# EAGLE design Trig to Gate Converter main V1 (EAGLE 7.7.0)
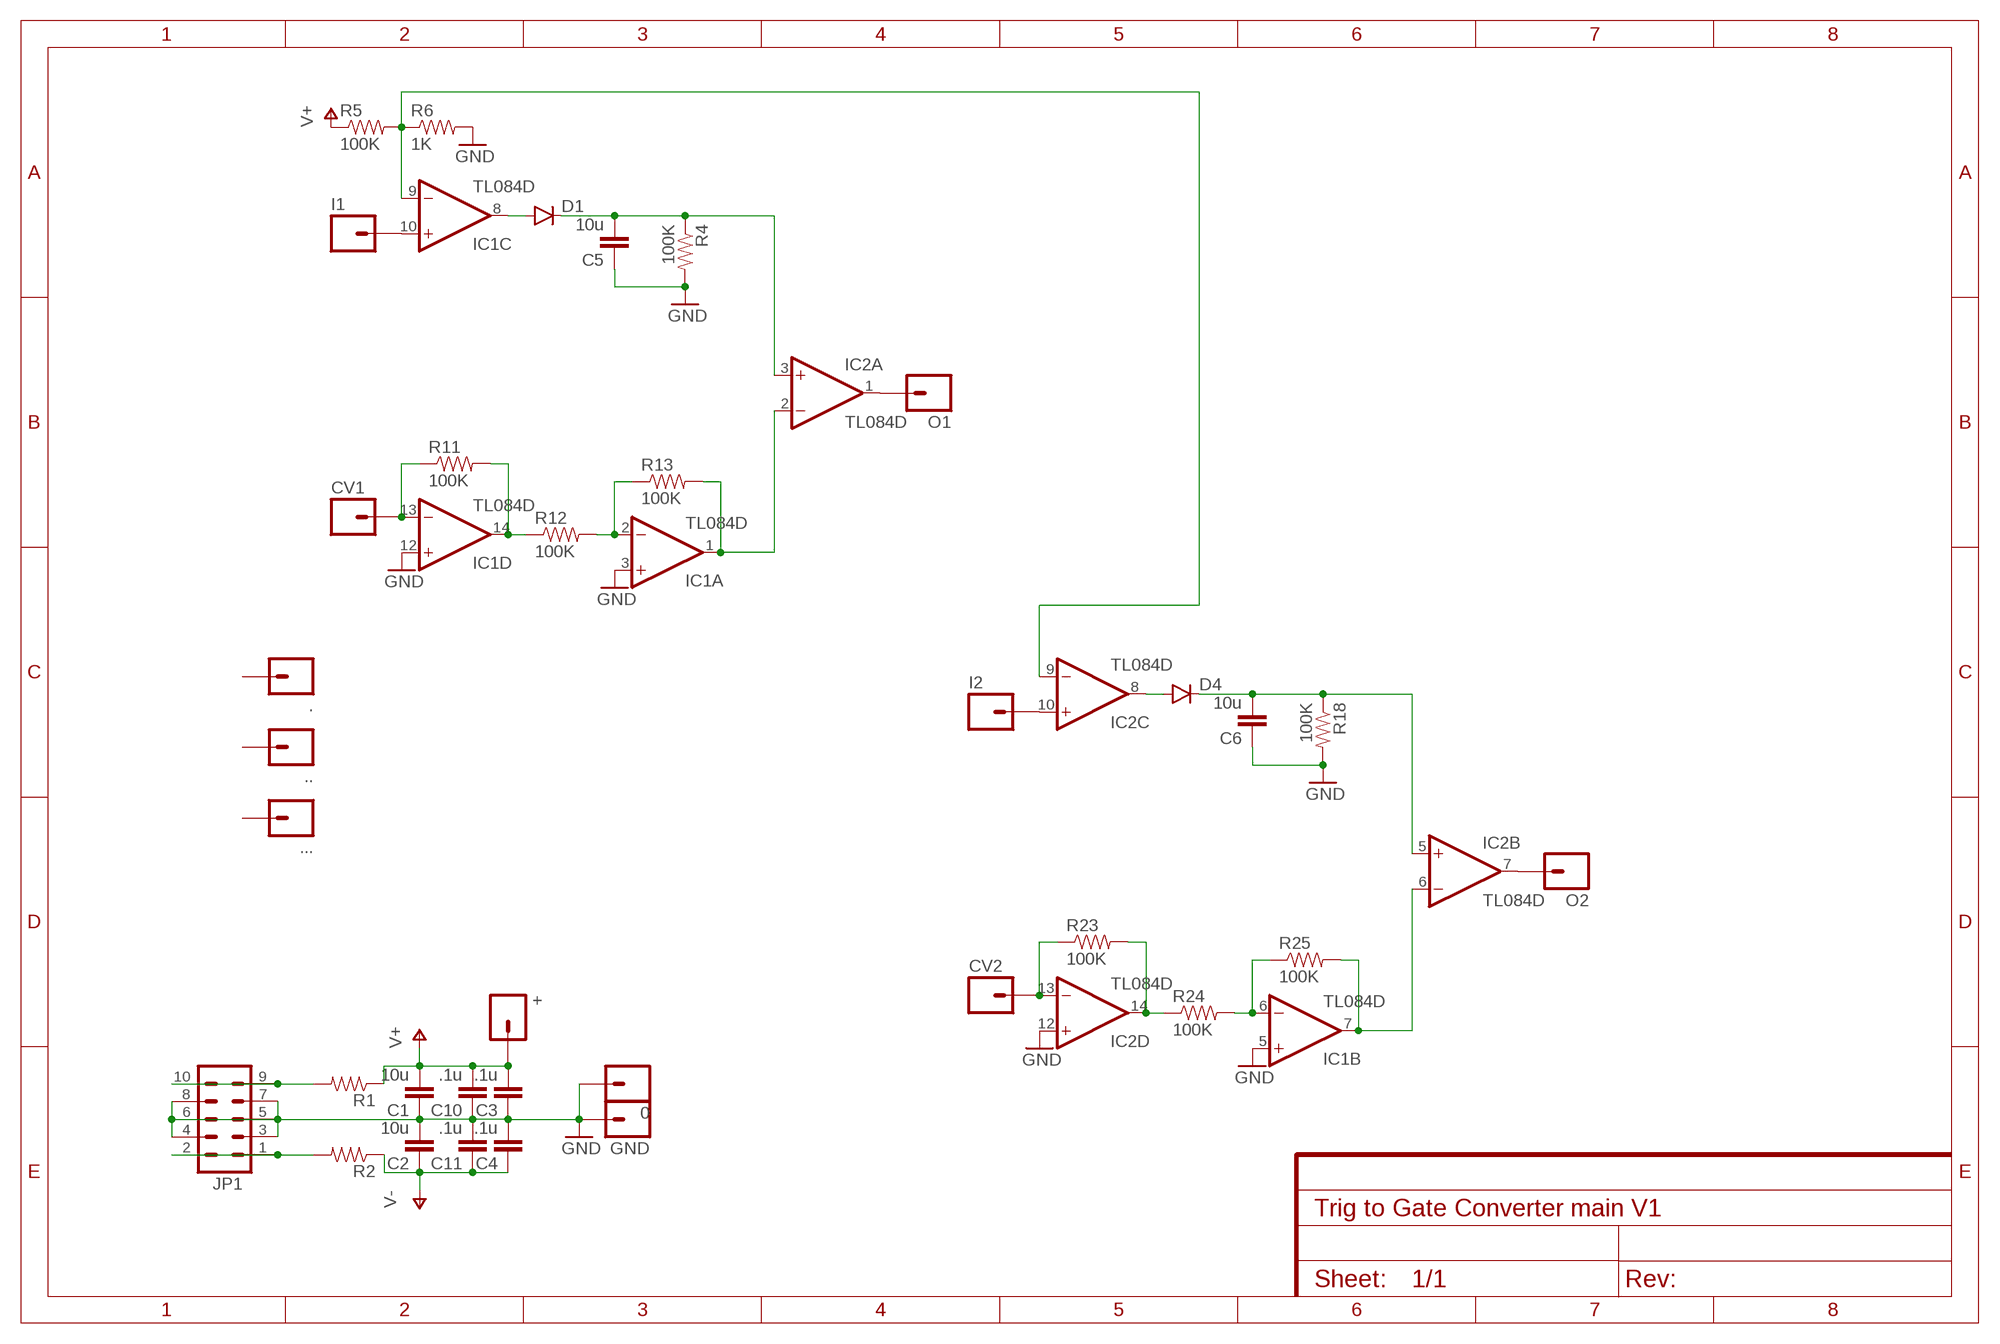
[diagram p0: schematic, sheet 1]

## Parts
0  M01PTH  [1X01]
+  M01PTH  [1X01]
.  M01PTH  [1X01]
..  M01PTH  [1X01]
...  M01PTH  [1X01]
C1  10u  CAP1206  [1206]
C2  10u  CAP1206  [1206]
C3  .1u  CAP0805  [0805]
C4  .1u  CAP0805  [0805]
C5  10u  CAP1206  [1206]
C6  10u  CAP1206  [1206]
C10  .1u  CAP0805  [0805]
C11  .1u  CAP0805  [0805]
CV1  M01PTH  [1X01]
CV2  M01PTH  [1X01]
D1  DIODESOD123  [SOD-123]
D4  DIODESOD123  [SOD-123]
GND  M01PTH  [1X01]
I1  M01PTH  [1X01]
I2  M01PTH  [1X01]
IC1  TL084D  [SO14]
IC2  TL084D  [SO14]
JP1  M05X2PTH  [AVR_ICSP]
O1  M01PTH  [1X01]
O2  M01PTH  [1X01]
R1  RESISTOR0805-RES  [0805]
R2  RESISTOR0805-RES  [0805]
R4  100K  RESISTOR0805-RES  [0805]
R5  100K  RESISTOR0805-RES  [0805]
R6  1K  RESISTOR0805-RES  [0805]
R11  100K  RESISTOR0805-RES  [0805]
R12  100K  RESISTOR0805-RES  [0805]
R13  100K  RESISTOR0805-RES  [0805]
R18  100K  RESISTOR0805-RES  [0805]
R23  100K  RESISTOR0805-RES  [0805]
R24  100K  RESISTOR0805-RES  [0805]
R25  100K  RESISTOR0805-RES  [0805]

## Nets
GND: 0.1 C1.1 C2.2 C3.1 C4.2 C5.1 C6.1 C10.1 C11.2 GND.1 IC1.3(A:+IN) IC1.5(B:+IN) IC1.12(D:+IN) IC2.12(D:+IN) JP1.3 JP1.4 JP1.5 JP1.6 JP1.7 JP1.8 R4.2 R6.2 R18.2
N$1: I1.1 IC1.10(C:+IN)
N$2: I2.1 IC2.10(C:+IN)
N$3: IC1.9(C:-IN) IC2.9(C:-IN) R5.2 R6.1
N$4: IC2.1(A:OUT) O1.1
N$5: IC2.7(B:OUT) O2.1
N$9: CV1.1 IC1.13(D:-IN) R11.1
N$12: D1.A IC1.8(C:OUT)
N$13: C5.2 D1.C IC2.3(A:+IN) R4.1
N$15: IC1.14(D:OUT) R11.2 R12.1
N$16: IC1.2(A:-IN) R12.2 R13.1
N$17: IC1.1(A:OUT) IC2.2(A:-IN) R13.2
N$21: JP1.9 JP1.10 R1.2
N$22: JP1.1 JP1.2 R2.2
N$27: CV2.1 IC2.13(D:-IN) R23.1
N$30: D4.A IC2.8(C:OUT)
N$31: C6.2 D4.C IC2.5(B:+IN) R18.1
N$32: IC2.14(D:OUT) R23.2 R24.1
N$33: IC1.6(B:-IN) R24.2 R25.1
N$34: IC1.7(B:OUT) IC2.6(B:-IN) R25.2
V+: +.1 C1.2 C3.2 C10.2 R1.1 R5.1
V-: C2.1 C4.1 C11.1 R2.1
Unconnected: ..1 ...1 ....1

## Power pins joined to a net without a drawn wire
V+: IC1.4(P:V+) IC2.4(P:V+)
V-: IC1.11(P:V-) IC2.11(P:V-)

## Library data of the parts
0 + . .. ... CV1 CV2 GND I1 I2 O1 O2 = SparkFun-Connectors:M01: Header 1 Standard 1-pin 0.1" header. Use with straight break away headers (SKU : PRT-00116), right angle break away headers (PRT-00553), swiss pins (PRT-00743), machine pins (PRT-00117), and female headers (PRT-00115).
C1-C6 C10 C11 = SparkFun-Capacitors:CAP: Capacitor Standard 0603 ceramic capacitor, and 0.1" leaded capacitor.
D1 D4 = SparkFun-DiscreteSemi:DIODE: Diode These are standard reverse protection diodes and small signal diodes. SMA package can handle up to about 1A. SOD-323 can handle about 200mA. What the SOD-323 package when ordering, there are some mfgs out there that are 5-pin packages.
IC1 IC2 = linear:TL084: OP AMP
JP1 = SparkFun-Connectors:M05X2: Header 5x2 Standard 10-pin dual row 0.1" header. Commonly used with AVR-ISP. Use with Spark Fun Electronics SKU: PRT-00778
R1 R2 R4-R6 R11-R13 R18 R23-R25 = SparkFun-Resistors:RESISTOR: Resistor Basic schematic elements and footprints for 0603, 1206, and PTH resistors.

## Board
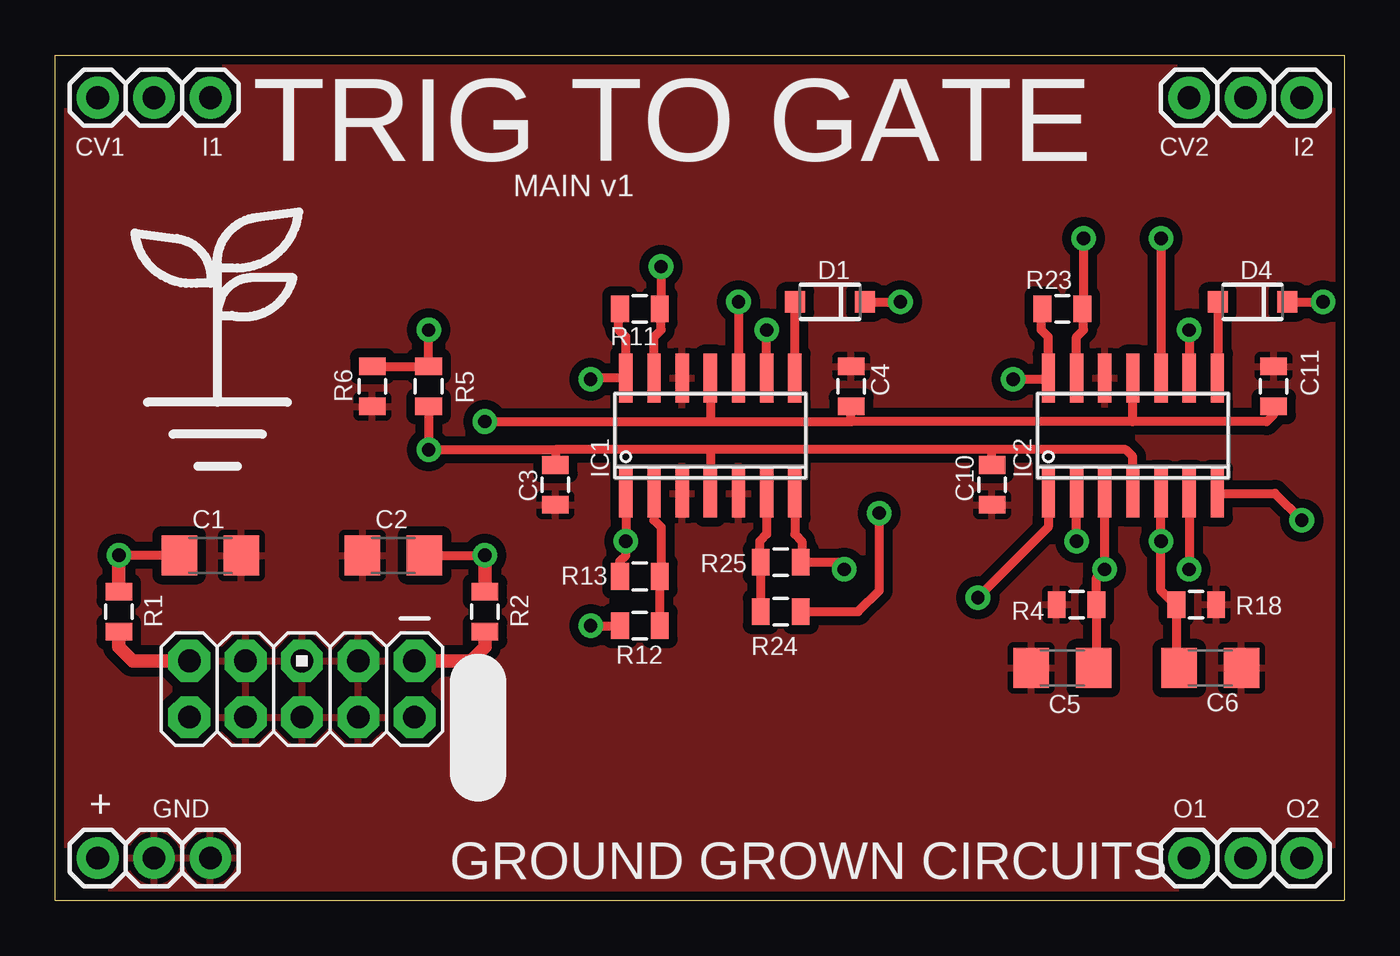
[diagram p1: board, top side]
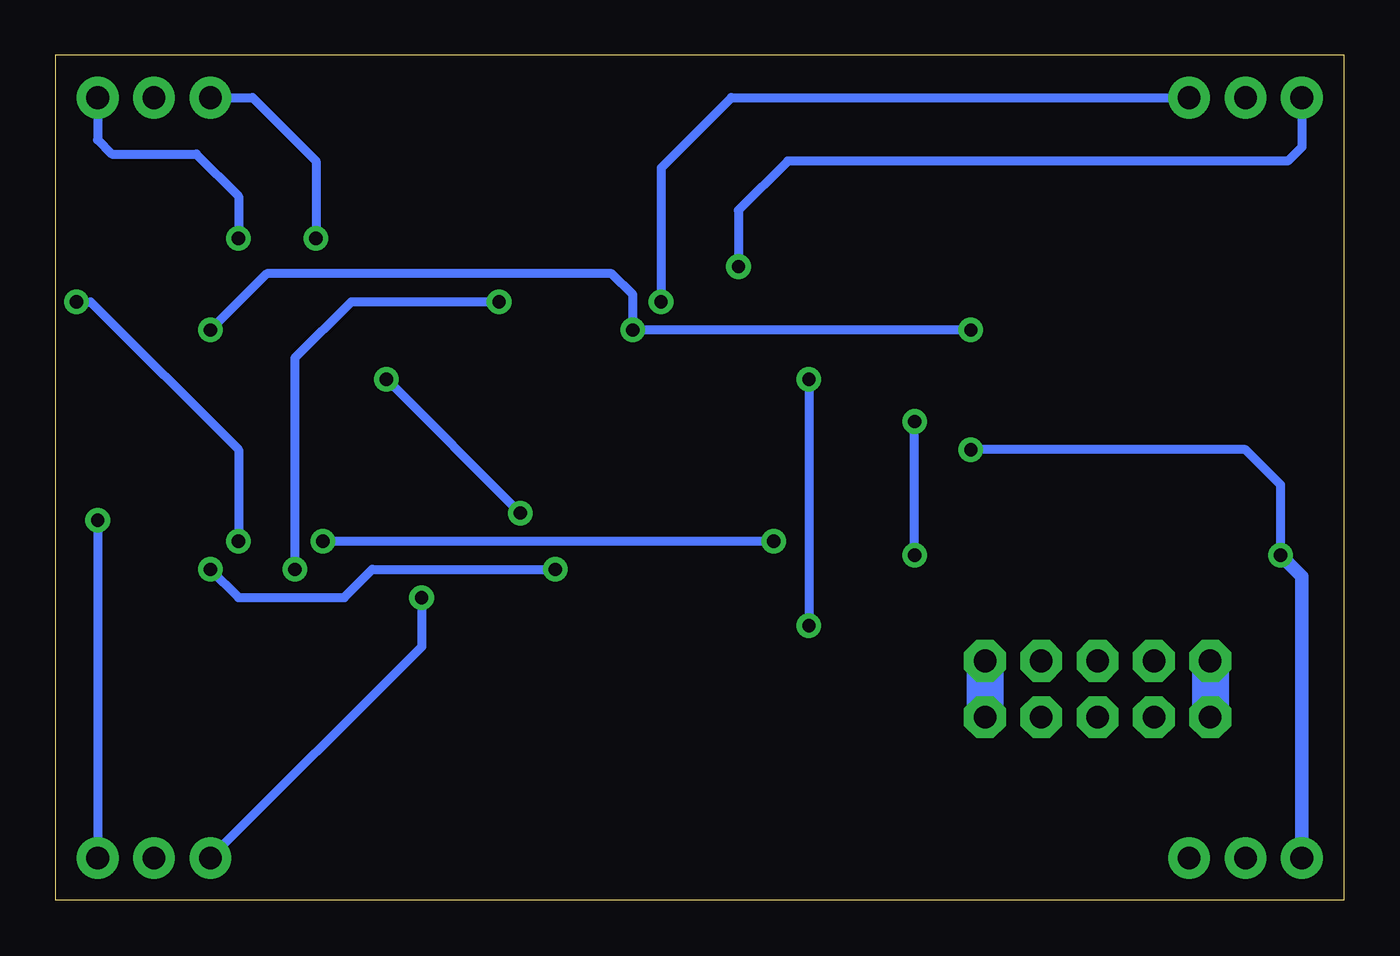
[diagram p2: board, bottom side, seen from below]

Size 58.1 x 38.1 mm. Coordinates in mm from the lower left corner, seen from the top.
Outline: 0,0 58.1,0 58.1,38.1 0,38.1 0,0
Copper layers (1*16): Top 0.035mm / dielectric 1.5mm / Bottom 0.035mm
Design rules "SparkFun": minimum track width 8mil, minimum drill 20mil, track to track 8mil, track to pad 8mil, pad to pad 8mil, via to via 8mil, smd to smd 8mil, copper to edge 8mil, drill to drill 8mil, minimum pad ring 12mil, minimum via ring 10mil, stop-mask expansion 4mil, vias tented up to drill 20mil, thermal gap 10mil

### Footprints (pad centres in the part's own frame; a part is rotated, then mirrored left to right if it is on the bottom)
1X01 = drill 1.016 pad 1.88: 1 0,0
1206 = smd 1.6 x 1.8: 1 -1.4,0; 2 1.4,0
0805 = smd 0.8 x 1.2: 1 -0.9,0; 2 0.9,0
SOD-123 = smd 0.9 x 0.95: A 1.575,0; C -1.575,0
SO14 = smd 0.6 x 2.2: 1 -3.81,-2.6; 2 -2.54,-2.6; 3 -1.27,-2.6; 4 0,-2.6; 5 1.27,-2.6; 6 2.54,-2.6; 7 3.81,-2.6; 8 3.81,2.6; 9 2.54,2.6; 10 1.27,2.6; 11 0,2.6; 12 -1.27,2.6; 13 -2.54,2.6; 14 -3.81,2.6
AVR_ICSP = drill 1.016 pad 1.88 octagon: 1 -1.27,5.08; 2 1.27,5.08; 3 -1.27,2.54; 4 1.27,2.54; 5 -1.27,0; 6 1.27,0; 7 -1.27,-2.54; 8 1.27,-2.54; 9 -1.27,-5.08; 10 1.27,-5.08

### Placement (x,y rotation side)
0  4.45,1.91 0 top
+  1.91,1.91 0 top
.  4.45,36.2 0 top
..  53.66,36.2 0 top
...  53.66,1.91 0 top
C1  6.99,15.56 180 top
C2  15.24,15.56 180 top
C3  22.54,18.73 90 top
C4  35.88,23.18 90 top
C5  45.4,10.48 0 top
C6  52.07,10.48 180 top
C10  42.23,18.73 90 top
C11  54.93,23.18 90 top
CV1  1.91,36.2 0 top
CV2  51.12,36.2 0 top
D1  34.92,26.99 180 top
D4  53.98,26.99 180 top
GND  6.99,1.91 0 top
I1  6.99,36.2 0 top
I2  56.2,36.2 0 top
IC1  29.53,20.95 0 top
IC2  48.58,20.95 0 top
JP1  11.11,9.53 270 top
O1  51.12,1.91 0 top
O2  56.2,1.91 0 top
R1  2.86,13.02 270 top
R2  19.37,13.02 270 top
R4  46.04,13.34 180 top
R5  16.83,23.18 90 top
R6  14.29,23.18 270 top
R11  26.35,26.67 180 top
R12  26.35,12.38 0 top
R13  26.35,14.61 180 top
R18  51.44,13.34 0 top
R23  45.4,26.67 180 top
R24  32.7,13.02 180 top
R25  32.7,15.24 0 top
U$1  [LOGO_MED]  7.3,22.54 0 top

### Tracks (layer width: path | path; a pad name or v marks a point on that pad's centre or on a via)
GND
  pour Top (isolate 0.406): 0,0 0,38.1 58.1,38.1 58.1,0
N$1  (via drill 0.6)
  Top 0.406: v30.8,26.99 IC1.10
  Bottom 0.406: v30.8,26.99 30.8,33.02 27.62,36.2 I1.1
N$2  (via drill 0.6)
  Top 0.406: v49.85,29.84 IC2.10
  Bottom 0.406: I2.1 56.2,34.29 55.56,33.66 51.75,33.66 49.85,31.75 v49.85,29.84
N$3  (via drill 0.6)
  Top 0.406: IC1.9 v32.07,25.72 | v51.12,25.72 IC2.9 | v16.83,25.72 R5.2 R6.1
  Bottom 0.406: v51.12,25.72 48.58,28.26 33.02,28.26 32.07,27.3 v32.07,25.72 v16.83,25.72
N$4  (via drill 0.6)
  Top 0.406: IC2.1 44.77,16.83 v41.59,13.65
  Bottom 0.406: v41.59,13.65 41.59,11.43 O1.1
N$5  (via drill 0.6)
  Top 0.406: IC2.7 54.99,18.36 v56.2,17.14
  Bottom 0.406: v56.2,17.14 O2.1
N$9  (via drill 0.6)
  Top 0.406: v27.3,28.57 27.3,26.72 R11.1 27.3,26.62 27.3,25.72 26.99,25.4 IC1.13
  Bottom 0.406: CV1.1 1.91,33.97 2.54,33.34 25.08,33.34 27.3,31.11 v27.3,28.57
N$12
  Top 0.406: IC1.8 33.34,26.66 D1.A
N$13  (via drill 0.6)
  Top 0.406: D1.C v38.1,26.99 | IC2.3 v47.31,14.92 46.94,14.55 R4.1 46.94,10.61 C5.2
  Bottom 0.406: v38.1,26.99 44.77,26.99 47.31,24.45 v47.31,14.92
N$15  (via drill 0.6)
  Top 0.406: R11.2 25.4,26.62 25.4,25.72 25.72,25.4 IC1.14 24.19,23.55 v24.13,23.5 | v24.13,12.38 R12.1
  Bottom 0.406: v24.13,23.5 v24.13,12.38
N$16
  Top 0.406: R12.2 R13.1 27.3,14.66 27.3,16.83 26.99,17.14 IC1.2
N$17  (via drill 0.6)
  Top 0.406: IC1.1 v25.72,16.19 25.72,15.56 25.45,15.29 R13.2 | v46.04,16.19 IC2.2
  Bottom 0.406: v25.72,16.19 v46.04,16.19
N$21
  Top 0.61: JP1.9 3.49,10.79 2.86,11.43 R1.2
  Bottom 1.676: JP1.9 JP1.10
N$22
  Top 0.61: JP1.1 18.73,10.79 19.37,11.43 R2.2
  Bottom 1.676: JP1.1 JP1.2
N$27  (via drill 0.6)
  Top 0.406: IC2.13 46.04,25.4 46.35,25.72 46.35,26.62 R23.1 46.35,26.72 v46.35,29.84
  Bottom 0.406: CV2.1 49.21,36.2 46.35,33.34 v46.35,29.84
N$30
  Top 0.406: D4.A 52.4,23.57 IC2.8
N$31  (via drill 0.6)
  Top 0.406: D4.C v57.15,26.99 | IC2.5 v49.85,16.19 49.85,13.97 50.48,13.34 R18.1 50.53,10.61 C6.2
  Bottom 0.406: v57.15,26.99 56.52,26.99 49.85,20.32 v49.85,16.19
N$32  (via drill 0.6)
  Top 0.406: R23.2 44.45,26.62 44.45,25.72 44.77,25.4 IC2.14 44.71,23.5 v43.18,23.5 | R24.1 36.2,13.02 37.15,13.97 v37.15,17.46
  Bottom 0.406: v37.15,17.46 v43.18,23.5
N$33
  Top 0.406: R24.2 R25.1 31.75,15.29 31.75,16.19 32.07,16.51 IC1.6
N$34  (via drill 0.6)
  Top 0.406: IC1.7 33.34,16.51 33.66,16.19 33.66,15.29 R25.2 35.24,15.24 v35.56,14.92 | IC2.6 v51.12,14.92
  Bottom 0.406: v51.12,14.92 49.85,13.65 45.09,13.65 43.81,14.92 v35.56,14.92
V+  (via drill 0.6)
  Top 0.406: IC2.4 48.58,20 48.26,20.32 42.23,20.32 | 42.23,20.32 29.53,20.32 | 29.53,20.32 IC1.4 | C10.2 42.23,20.32 | 29.53,20.32 22.54,20.32 | 22.54,20.32 C3.2 | C1.2 v2.86,15.56 | 22.54,20.32 v16.83,20.32 R5.1
  Top 0.61: R1.1 v2.86,15.56
  Bottom 0.406: v2.86,15.56 2.86,18.73 4.45,20.32 v16.83,20.32
  Bottom 0.61: +.1 1.91,14.61 v2.86,15.56
V-  (via drill 0.6)
  Top 0.406: C11.1 54.93,21.91 54.61,21.59 48.58,21.59 | 48.58,21.59 IC2.11 | 48.58,21.59 35.88,21.59 | 35.88,21.59 C4.1 | IC1.11 29.53,21.59 | 29.53,21.59 35.88,21.59 | C2.1 v19.37,15.56 | v19.37,21.59 29.53,21.59
  Top 0.61: R2.1 v19.37,15.56
  Bottom 0.406: v19.37,15.56 v19.37,21.59

### Text on the board
tPlace: TRIG TO GATE | MAIN v1 | GROUND GROWN CIRCUITS